# Altium schematic sheet [2]Analog.SchDoc
size A3
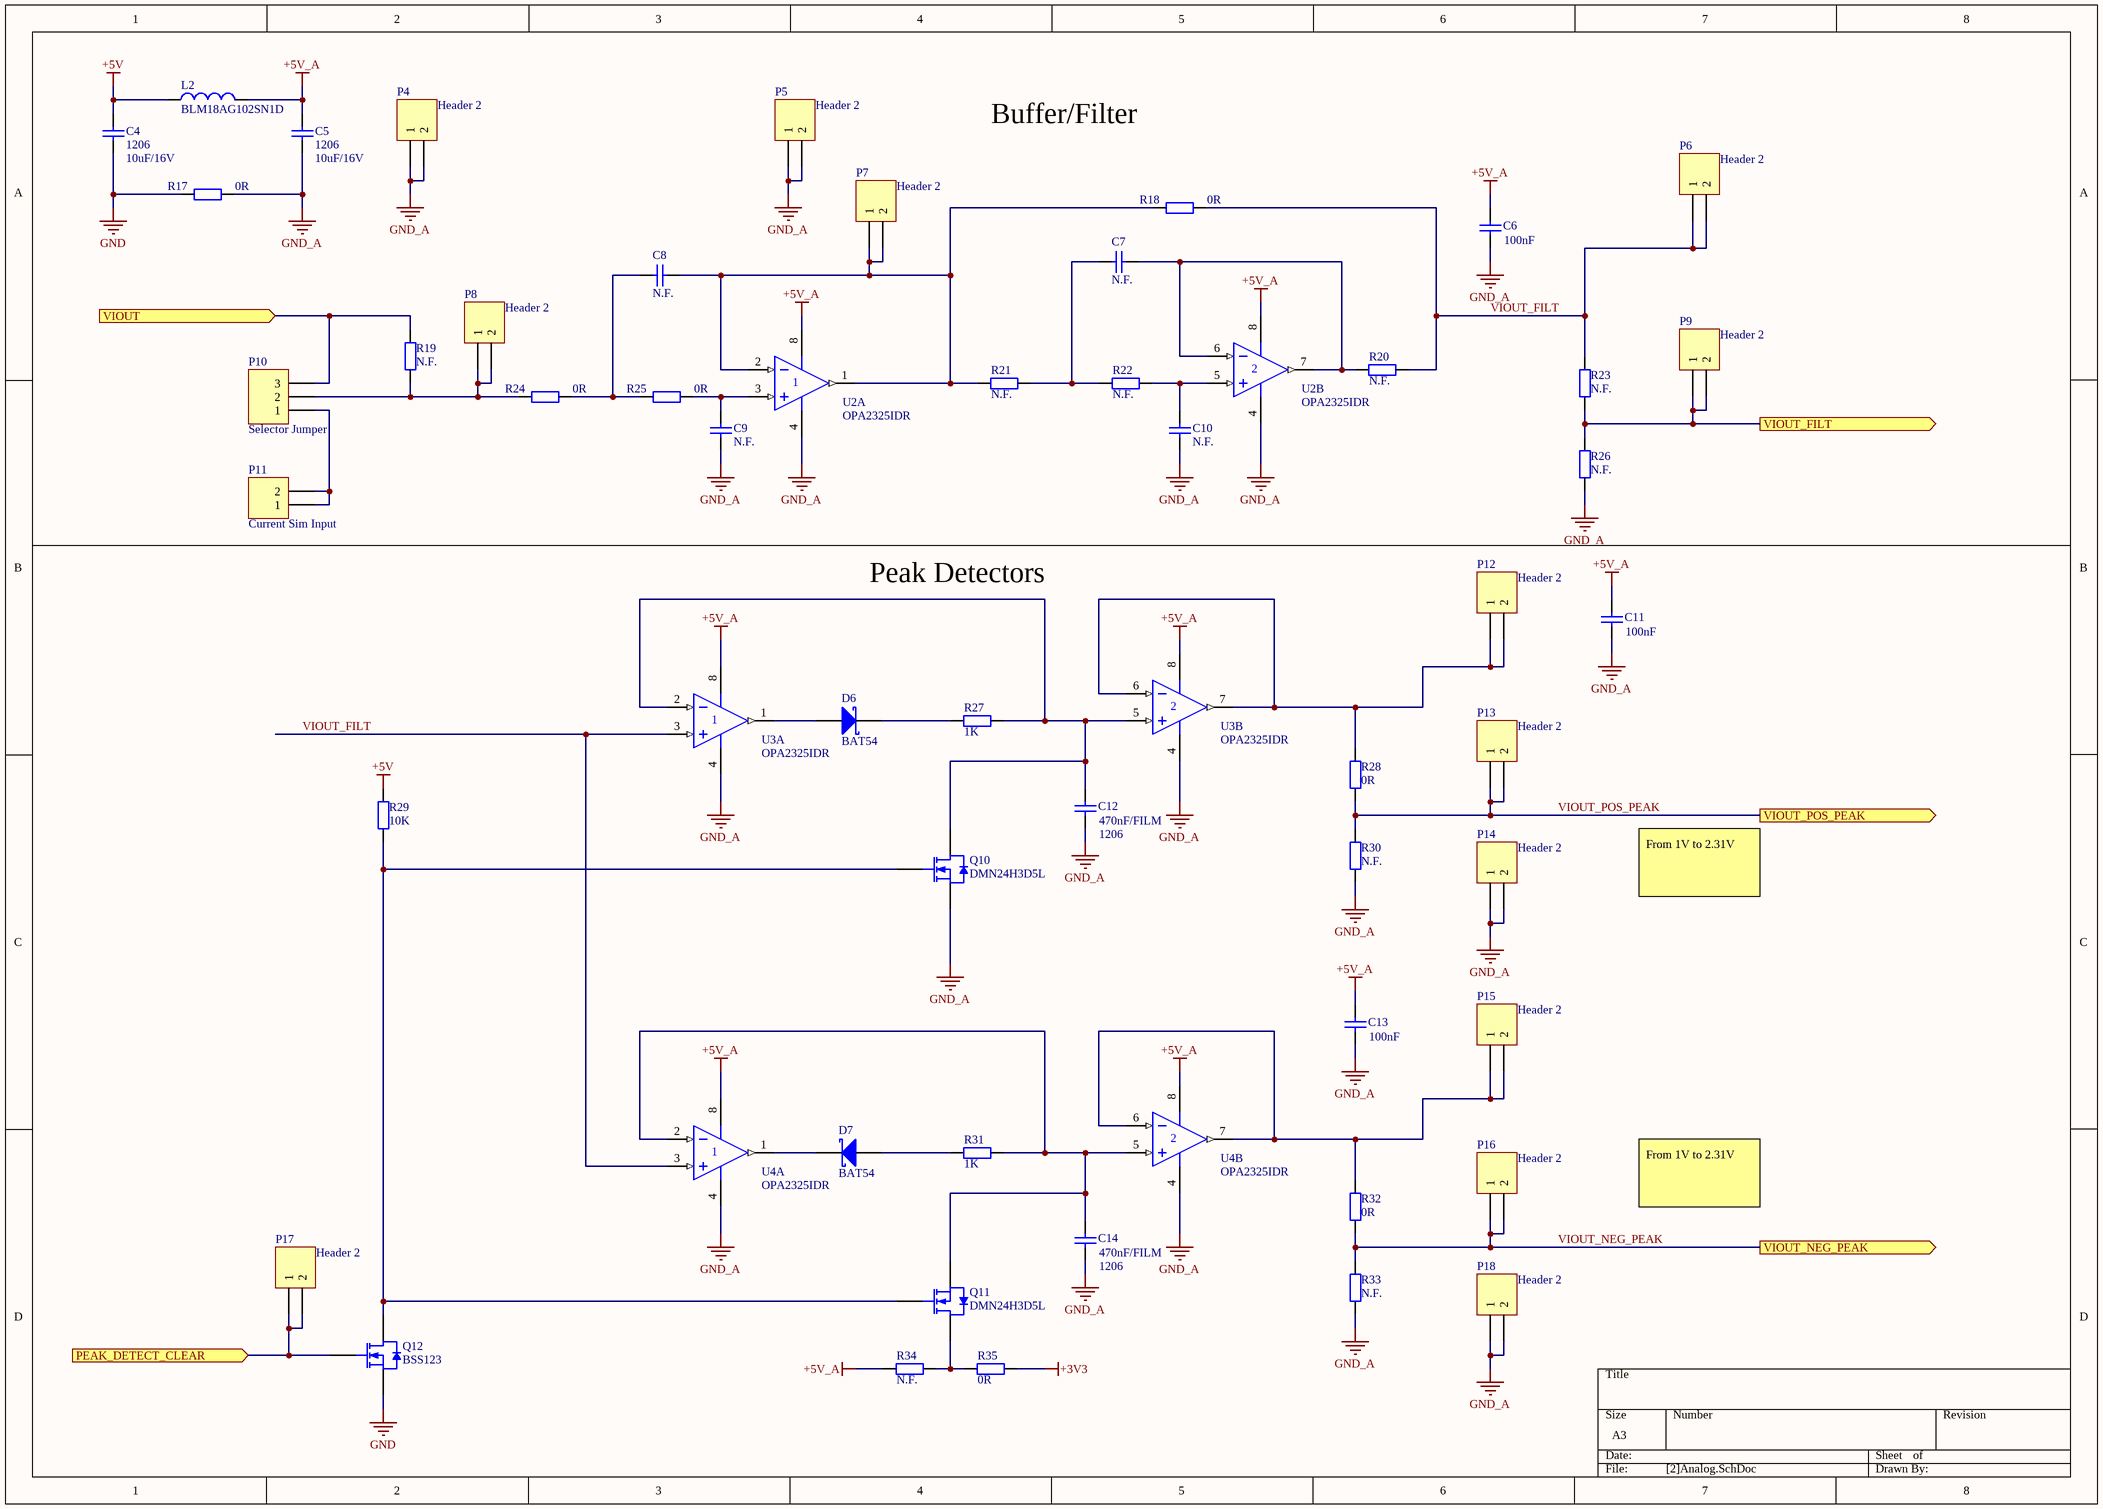
[diagram p0: [2]Analog.SchDoc]

## Parts
C4  1206  value 10uF/16V  [C1206]
C5  1206  value 10uF/16V  [C1206]
C6  value 100nF  [1608[0603]]  (hidden comment: 0603)
C7  value N.F.  [1608[0603]]  (hidden comment: 0603)
C8  value N.F.  [1608[0603]]  (hidden comment: 0603)
C9  value N.F.  [1608[0603]]  (hidden comment: 0603)
C10  value N.F.  [1608[0603]]  (hidden comment: 0603)
C11  value 100nF  [1608[0603]]  (hidden comment: 0603)
C12  value 470nF/FILM  Case Code (in): 1206  [C1206]  (hidden comment: 0603)
C13  value 100nF  [1608[0603]]  (hidden comment: 0603)
C14  value 470nF/FILM  Case Code (in): 1206  [C1206]  (hidden comment: 0603)
D6  BAT54  [SOT-23_N]
D7  BAT54  [SOT-23_N]
L2  BLM18AG102SN1D  [1608[0603]]
P4  Header 2  [HDR1X2]
P5  Header 2  [HDR1X2]
P6  Header 2  [HDR1X2]
P7  Header 2  [HDR1X2]
P8  Header 2  [HDR1X2]
P9  Header 2  [HDR1X2]
P10  Selector Jumper  [HDR1X3]
P11  Current Sim Input  [HDR1X2]
P12  Header 2  [HDR1X2]
P13  Header 2  [HDR1X2]
P14  Header 2  [HDR1X2]
P15  Header 2  [HDR1X2]
P16  Header 2  [HDR1X2]
P17  Header 2  [HDR1X2]
P18  Header 2  [HDR1X2]
Q10  DMN24H3D5L  [SOT23_N]
Q11  DMN24H3D5L  [SOT23_N]
Q12  BSS123  [SOT23_N]
R17  value 0R  [J1-0603]  (hidden comment: 0603)
R18  value 0R  [J1-0603]  (hidden comment: 0603)
R19  value N.F.  [J1-0603]  (hidden comment: 0603)
R20  value N.F.  [J1-0603]  (hidden comment: 0603)
R21  value N.F.  [J1-0603]  (hidden comment: 0603)
R22  value N.F.  [J1-0603]  (hidden comment: 0603)
R23  value N.F.  [J1-0603]  (hidden comment: 0603)
R24  value 0R  [J1-0603]  (hidden comment: 0603)
R25  value 0R  [J1-0603]  (hidden comment: 0603)
R26  value N.F.  [J1-0603]  (hidden comment: 0603)
R27  value 1K  [J1-0603]  (hidden comment: 0603)
R28  value 0R  [J1-0603]  (hidden comment: 0603)
R29  value 10K  [J1-0603]  (hidden comment: 0603)
R30  value N.F.  [J1-0603]  (hidden comment: 0603)
R31  value 1K  [J1-0603]  (hidden comment: 0603)
R32  value 0R  [J1-0603]  (hidden comment: 0603)
R33  value N.F.  [J1-0603]  (hidden comment: 0603)
R34  value N.F.  [J1-0603]  (hidden comment: 0603)
R35  value 0R  [J1-0603]  (hidden comment: 0603)
U2  OPA2325IDR  [D008_M]  (parts A,B of 2)
U3  OPA2325IDR  [D008_M]  (parts A,B of 2)
U4  OPA2325IDR  [D008_M]  (parts A,B of 2)

## Ports
PEAK_DETECT_CLEAR (in), VIOUT (in), VIOUT_FILT (out), VIOUT_NEG_PEAK (out), VIOUT_POS_PEAK (out)

## Nets
+3V3: R35.2
+5V: C4.2 L2.1 R29.2
+5V_A: C5.2 C6.2 C11.2 C13.2 L2.2 R34.1 U2.8(V+) U3.8(V+) U4.8(V+)
GND: C4.1 Q12.2(S) R17.2
GND_A: C5.1 C6.1 C9.2 C10.2 C11.1 C12.1 C13.1 C14.1 P4.1 P4.2 P5.1 P5.2 P14.1 P14.2 P18.1 P18.2 Q10.2(S) R17.1 R26.2 R30.2 R33.2 U2.4(V-) U3.4(V-) U4.4(V-)
PEAK_DETECT_CLEAR: P17.1 P17.2 Q12.1(G) ; port PEAK_DETECT_CLEAR
VIOUT: P10.3 R19.1 ; port VIOUT
VIOUT_FILT: P6.1 P6.2 R18.1 R20.1 R23.1 U3.3(IN+) U4.3(IN+)
VIOUT_FILT: P9.1 P9.2 R23.2 R26.1 ; port VIOUT_FILT  [a separate net that carries the same name]
VIOUT_NEG_PEAK: P16.1 P16.2 R32.2 R33.1 ; port VIOUT_NEG_PEAK
VIOUT_POS_PEAK: P13.1 P13.2 R28.2 R30.1 ; port VIOUT_POS_PEAK
NetC7_1: C7.1 R20.2 U2.6(IN-) U2.7(OUT)
NetC7_2: C7.2 R21.1 R22.2
NetC8_1: C8.1 P7.1 P7.2 R18.2 R21.2 U2.1(OUT) U2.2(IN-)
NetC8_2: C8.2 R24.1 R25.2
NetC9_1: C9.1 R25.1 U2.3(IN+)
NetC10_1: C10.1 R22.1 U2.5(IN+)
NetC12_2: C12.2 Q10.3(D) R27.1 U3.2(IN-) U3.5(IN+)
NetC14_2: C14.2 Q11.2(S) R31.1 U4.2(IN-) U4.5(IN+)
NetD6_1: D6.1(A) U3.1(OUT)
NetD6_3: D6.3(K) R27.2
NetD7_1: D7.1(A) R31.2
NetD7_3: D7.3(K) U4.1(OUT)
NetP8_1: P8.1 P8.2 P10.2 R19.2 R24.2
NetP10_1: P10.1 P11.1 P11.2
NetP12_1: P12.1 P12.2 R28.1 U3.6(IN-) U3.7(OUT)
NetP15_1: P15.1 P15.2 R32.1 U4.6(IN-) U4.7(OUT)
NetQ10_1: Q10.1(G) Q11.1(G) Q12.3(D) R29.1
NetQ11_3: Q11.3(D) R34.2 R35.1

## Notes on the sheet
- Buffer/Filter
- Peak Detectors
- From 1V to 2.31V

## Library data of the parts
C4-C11 C13 = Cap: Capacitor; Note: We have them in Bulgaria; Published: 8-Jun-2000; LatestRevisionDate: 17-Jul-2002; LatestRevisionNote: Re-released for DXP Platform.; PackageReference: RAD-0.3; Publisher: Altium Limited; PackageDescription: Radial Cap, Thru-Hole; 2 Leads; 0.3 in Pin Spacing
  C4 C5: Distributor Link: http://uk.farnell.com/kemet/c1206c106k4ractu/cap-mlcc-x7r-10uf-16v-1206/dp/1463368; Case Code (in): 1206
  C6 C11 C13: Distributor Link: http://uk.farnell.com/kemet/c0603x104k4ractu/cap-mlcc-x7r-100nf-16v-0603/dp/1414027; Case Code (in): 0603
  C7-C10: Case Code (in): 0603
C12 C14 = Cap: Capacitor; Note: Get 6 more; Published: 8-Jun-2000; LatestRevisionDate: 17-Jul-2002; LatestRevisionNote: Re-released for DXP Platform.; PackageReference: RAD-0.3; Publisher: Altium Limited; PackageDescription: Radial Cap, Thru-Hole; 2 Leads; 0.3 in Pin Spacing; Distributor Link: https://eu.mouser.com/ProductDetail/Panasonic/ECP-U1C474MA5?qs=sGAEpiMZZMv1cc3ydrPrF%252BfZ13WJ%2Fr1%2Fb%252But97GYF3A%3D
D6 D7 = Diode BAT17: Silicon RF Schottky Diode for Mixer Applications in the VHF/UHF Range; Manufacturer Name: ON SEMICONDUCTOR; Manufacturer Part No.: BAT54LT1G; Note: We have them in Bulgaria; Published: 21-Mar-2003; LatestRevisionDate: 29-May-2009; LatestRevisionNote: IPC-7351 Footprint Added.; DatasheetVersion: Oct-1999; PackageVersion: Sep-2001; PackageReference: SOT-23; Publisher: Altium Limited; PackageDescription: 3-Pin SOT-23 Package 0.95 mm Pitch, 2.5 mm Lead Span; ComponentLink1Description: Manufacturer Link; ComponentLink1URL: http://www.infineon.com/; ComponentLink2Description: Datasheet; ComponentLink2URL: http://www.infineon.com/upload/Document/cmc_upload/documents/009/363/bat17series.pdf; Distributor Link: https://uk.farnell.com/on-semiconductor/bat54lt1g/diode-signal-30v-sot-23/dp/1431113
L2 = Inductor: Manufacturer Name: Murata; Note: We have them in Bulgaria; Manufacturer Part No.: BLM18AG102SN1D; Distributor Link: https://eu.mouser.com/ProductDetail/Murata-Electronics/BLM18AG102SN1D?qs=%2fha2pyFadui%252bmEFJIul6r5GpWOyARRlB97lxmShlzChqi9G%252bTjWC9w%3d%3d
P4-P9 P11-P18 = Header 2: Header, 2-Pin; LatestRevisionDate: 17-Jul-2002; LatestRevisionNote: Re-released for DXP Platform.; Publisher: Altium Limited
P10 = Header 3: Header, 3-Pin; LatestRevisionDate: 17-Jul-2002; LatestRevisionNote: Re-released for DXP Platform.; Publisher: Altium Limited
Q10 Q11 = BSS123: N-channel Enhancement Mode Vertical D-MOSFET; Manufacturer Name: Diodes Incorporated; Manufacturer Part No.: DMN24H3D5L-7; Note: Get 5 more.; Published: 17-Sep-2003; LatestRevisionDate: 12-Dec-2006; LatestRevisionNote: IPC-7351 Footprint Added.; DatasheetVersion: Apr-1995; PackageVersion: May-1999; PackageReference: SOT23; Publisher: Altium Limited; PackageDescription: 3-Pin SOT-23 Package 0.95 mm Pitch, 2.3 mm Lead Span; ComponentLink1Description: Manufacturer Link; ComponentLink1URL: http://www.semiconductors.philips.com/; ComponentLink2Description: Datasheet; ComponentLink2URL: http://www.semiconductors.philips.com/acrobat/datasheets/BSS123_3.pdf; Distributor Link: https://www.digikey.com/product-detail/en/diodes-incorporated/DMN24H3D5L-7/DMN24H3D5L-7DICT-ND/5126865
Q12 = BSS123: N-channel Enhancement Mode Vertical D-MOSFET; Manufacturer Name: ON Semiconductor; Note: We have them in Bulgaria; Published: 17-Sep-2003; LatestRevisionDate: 12-Dec-2006; LatestRevisionNote: IPC-7351 Footprint Added.; DatasheetVersion: Apr-1995; PackageVersion: May-1999; PackageReference: SOT23; Publisher: Altium Limited; PackageDescription: 3-Pin SOT-23 Package 0.95 mm Pitch, 2.3 mm Lead Span; ComponentLink1Description: Manufacturer Link; ComponentLink1URL: http://www.semiconductors.philips.com/; ComponentLink2Description: Datasheet; ComponentLink2URL: http://www.semiconductors.philips.com/acrobat/datasheets/BSS123_3.pdf; Distributor Link: https://eu.mouser.com/ProductDetail/ON-Semiconductor/BSS123LT1G?qs=sGAEpiMZZMshyDBzk1%2fWizSW%252bwlCH%2fhMYWCTWBfWgg8%3d; Manufacturer Part No.: BSS123
R17-R35 = Res2: Resistor; Note: We have them in Bulgaria; Published: 8-Jun-2000; LatestRevisionDate: 17-Jul-2002; LatestRevisionNote: Re-released for DXP Platform.; PackageReference: AXIAL-0.4; Publisher: Altium Limited; PackageDescription: Axial Device, Thru-Hole; 2 Leads; 0.4 in Pin Spacing; Case Code (in): 0603
  R17 R18 R24 R25 R28 R32 R35: Distributor Link: http://uk.farnell.com/yageo/rc0603fr-070rl/res-thick-film-0r-1-0-1w-0603/dp/2309106
  R27 R31: Distributor Link: https://uk.farnell.com/vishay/mct06030c1001fp500/res-1k-1-0-1w-0603-thin-film/dp/2325213
  R29: Distributor Link: http://uk.farnell.com/multicomp/mcwr06x1002ftl/res-thick-film-10k-1-0-1w-0603/dp/2447230
U2-U4 = MC1458D: Dual General-Purpose Operational Amplifier; Manufacturer Name: TI; Note: Get 6 more.; Published: 15-Apr-2002; LatestRevisionDate: 13-Apr-2006; LatestRevisionNote: IPC-7351 Footprint Added.; DatasheetVersion: May-1988; PackageVersion: Jan-1998; PackageReference: D008; Publisher: Altium Limited; PackageDescription: 8-Pin Small Outline Integrated Circuit 1.27 mm Pitch; Code_IPC: SOIC127P600-8; ComponentLink1Description: Manufacturer Link; ComponentLink1URL: http://www.ti.com/; ComponentLink2Description: Datasheet; ComponentLink2URL: http://www-s.ti.com/sc/ds/mc1458.pdf; Distributor Link: https://eu.mouser.com/ProductDetail/Texas-Instruments/OPA2325IDR?qs=%2Fha2pyFadujaAA%252BPt%2FaiSE4IhM8K7gbY8eM5jbLcXgs%3D; Manufacturer Part No.: OPA2325IDR